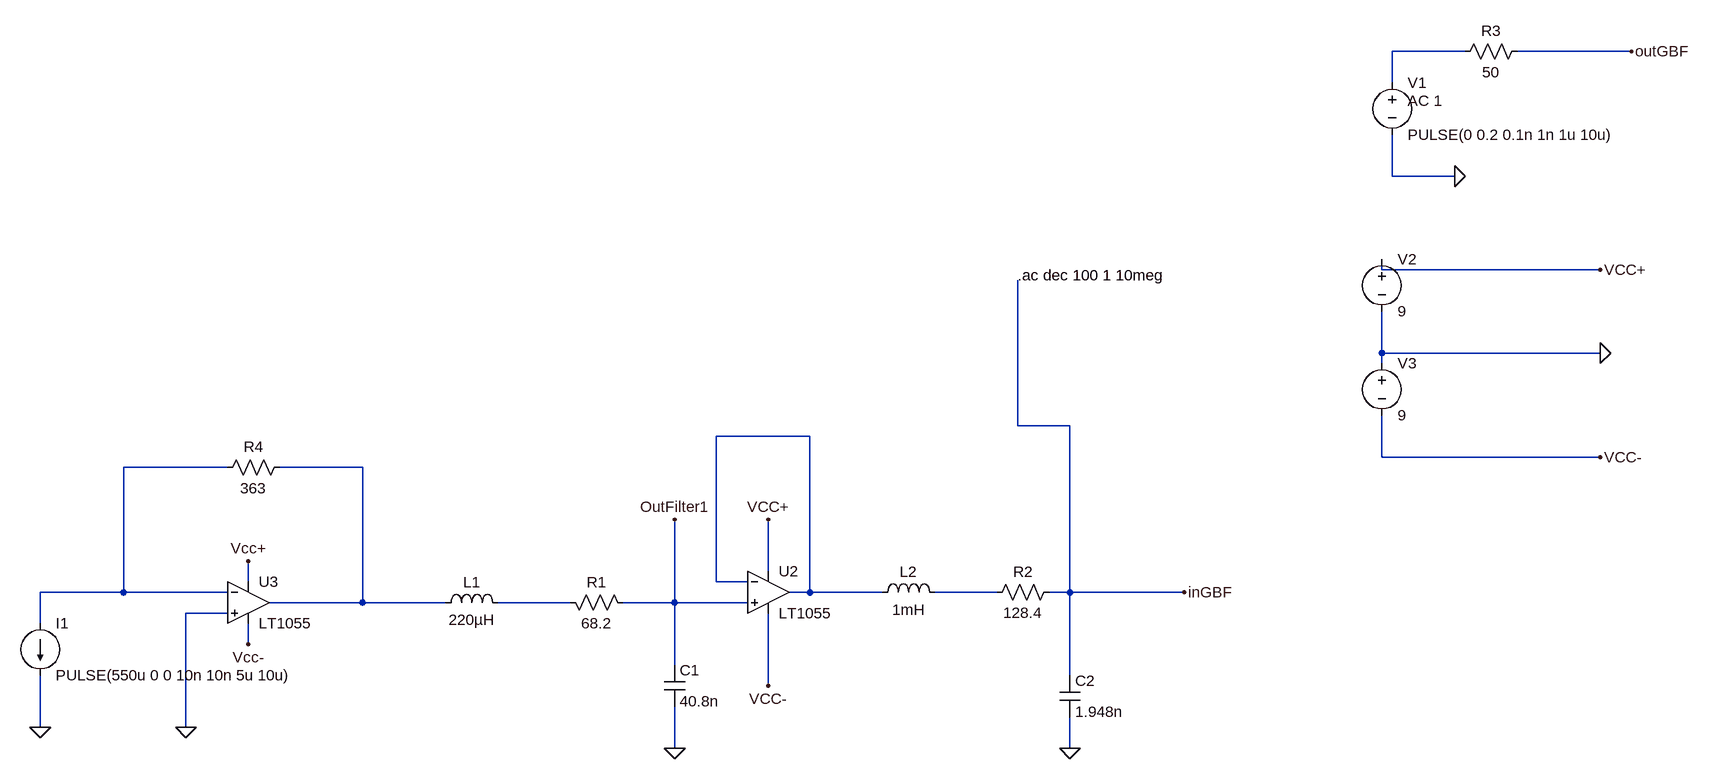
[diagram p0: schematic Cablage3.asc]
Cablage3.asc, the LTspice schematic file:
Version 4
SHEET 1 1896 852
WIRE 1536 -240 1424 -240
WIRE 1792 -240 1616 -240
WIRE 1424 -192 1424 -240
WIRE 1424 -48 1424 -112
WIRE 1520 -48 1424 -48
WIRE 1408 96 1408 80
WIRE 1744 96 1408 96
WIRE 1408 224 1408 160
WIRE 1744 224 1408 224
WIRE 1408 240 1408 224
WIRE 848 336 848 112
WIRE 928 336 848 336
WIRE 528 352 384 352
WIRE 1408 384 1408 320
WIRE 1744 384 1408 384
WIRE -368 400 -528 400
WIRE -160 400 -288 400
WIRE 464 560 464 480
WIRE -336 576 -336 544
WIRE 384 576 384 352
WIRE 432 576 384 576
WIRE -528 592 -528 400
WIRE -528 592 -656 592
WIRE -368 592 -528 592
WIRE 528 592 528 352
WIRE 528 592 496 592
WIRE 640 592 528 592
WIRE 816 592 720 592
WIRE 928 592 928 336
WIRE 928 592 896 592
WIRE 1104 592 928 592
WIRE -160 608 -160 400
WIRE -160 608 -304 608
WIRE -32 608 -160 608
WIRE 160 608 48 608
WIRE 320 608 320 480
WIRE 320 608 240 608
WIRE 432 608 320 608
WIRE -368 624 -432 624
WIRE -656 640 -656 592
WIRE -336 672 -336 640
WIRE 320 704 320 608
WIRE 928 720 928 592
WIRE 464 736 464 624
WIRE -656 800 -656 720
WIRE -432 800 -432 624
WIRE 320 832 320 768
WIRE 928 832 928 784
FLAG 464 480 VCC+
FLAG 320 832 0
FLAG 928 832 0
FLAG 464 736 VCC-
FLAG 320 480 OutFilter1
FLAG 1104 592 inGBF
FLAG 1520 -48 0
FLAG 1792 -240 outGBF
FLAG 1744 96 VCC+
FLAG 1744 384 VCC-
FLAG 1744 224 0
FLAG -432 800 0
FLAG -656 800 0
FLAG -336 544 Vcc+
FLAG -336 672 Vcc-
SYMBOL OpAmps\\LT1055 464 528 R0
SYMATTR InstName U2
SYMBOL ind -48 624 R270
WINDOW 0 32 56 VTop 2
WINDOW 3 5 56 VBottom 2
SYMATTR InstName L1
SYMATTR Value 220µH
SYMBOL ind 624 608 R270
WINDOW 0 32 56 VTop 2
WINDOW 3 5 56 VBottom 2
SYMATTR InstName L2
SYMATTR Value 1mH
SYMBOL res 256 624 M270
WINDOW 0 32 56 VTop 2
WINDOW 3 0 56 VBottom 2
SYMATTR InstName R1
SYMATTR Value 68.2
SYMBOL res 800 608 R270
WINDOW 0 32 56 VTop 2
WINDOW 3 0 56 VBottom 2
SYMATTR InstName R2
SYMATTR Value 128.4
SYMBOL cap 304 704 R0
SYMATTR InstName C1
SYMATTR Value 40.8n
SYMBOL cap 912 720 R0
SYMATTR InstName C2
SYMATTR Value 1.948n
SYMBOL voltage 1424 -208 R0
WINDOW 123 24 44 Left 2
WINDOW 39 0 0 Left 0
SYMATTR Value2 AC 1
SYMATTR InstName V1
SYMATTR Value PULSE(0 0.2 0.1n 1n 1u 10u)
SYMBOL res 1632 -256 R90
WINDOW 0 0 56 VBottom 2
WINDOW 3 32 56 VTop 2
SYMATTR InstName R3
SYMATTR Value 50
SYMBOL voltage 1408 64 R0
WINDOW 123 0 0 Left 0
WINDOW 39 0 0 Left 0
SYMATTR InstName V2
SYMATTR Value 9
SYMBOL voltage 1408 224 R0
WINDOW 123 0 0 Left 0
WINDOW 39 0 0 Left 0
SYMATTR InstName V3
SYMATTR Value 9
SYMBOL OpAmps\\LT1055 -336 544 R0
SYMATTR InstName U3
SYMBOL current -656 640 R0
WINDOW 123 0 0 Left 0
WINDOW 39 0 0 Left 0
SYMATTR InstName I1
SYMATTR Value PULSE(550u 0 0 10n 10n 5u 10u)
SYMBOL res -384 416 R270
WINDOW 0 32 56 VTop 2
WINDOW 3 0 56 VBottom 2
SYMATTR InstName R4
SYMATTR Value 363
SYMATTR SpiceLine tol=1 pwr=0.1
TEXT 848 104 Left 2 !.ac dec 100 1 10meg

The netlist it stands for:
* Cablage3.asc
XU2 OutFilter1 N002 VCC+ VCC- N002 LT1055  ; pins In+ In- V+ V- OUT
L1 N004 N006 220µH
L2 N002 N005 1mH
R1 OutFilter1 N006 68.2
R2 N005 inGBF 128.4
C1 OutFilter1 0 40.8n
C2 inGBF 0 1.948n
V1 N001 0 PULSE(0 0.2 0.1n 1n 1u 10u) AC 1
R3 outGBF N001 50
V2 VCC+ 0 9
V3 0 VCC- 9
XU3 0 N003 VCC+ VCC- N004 LT1055  ; pins In+ In- V+ V- OUT
I1 N003 0 PULSE(550u 0 0 10n 10n 5u 10u)
R4 N003 N004 363 tol=1 pwr=0.1
.ac dec 100 1 10meg
.backanno
.end